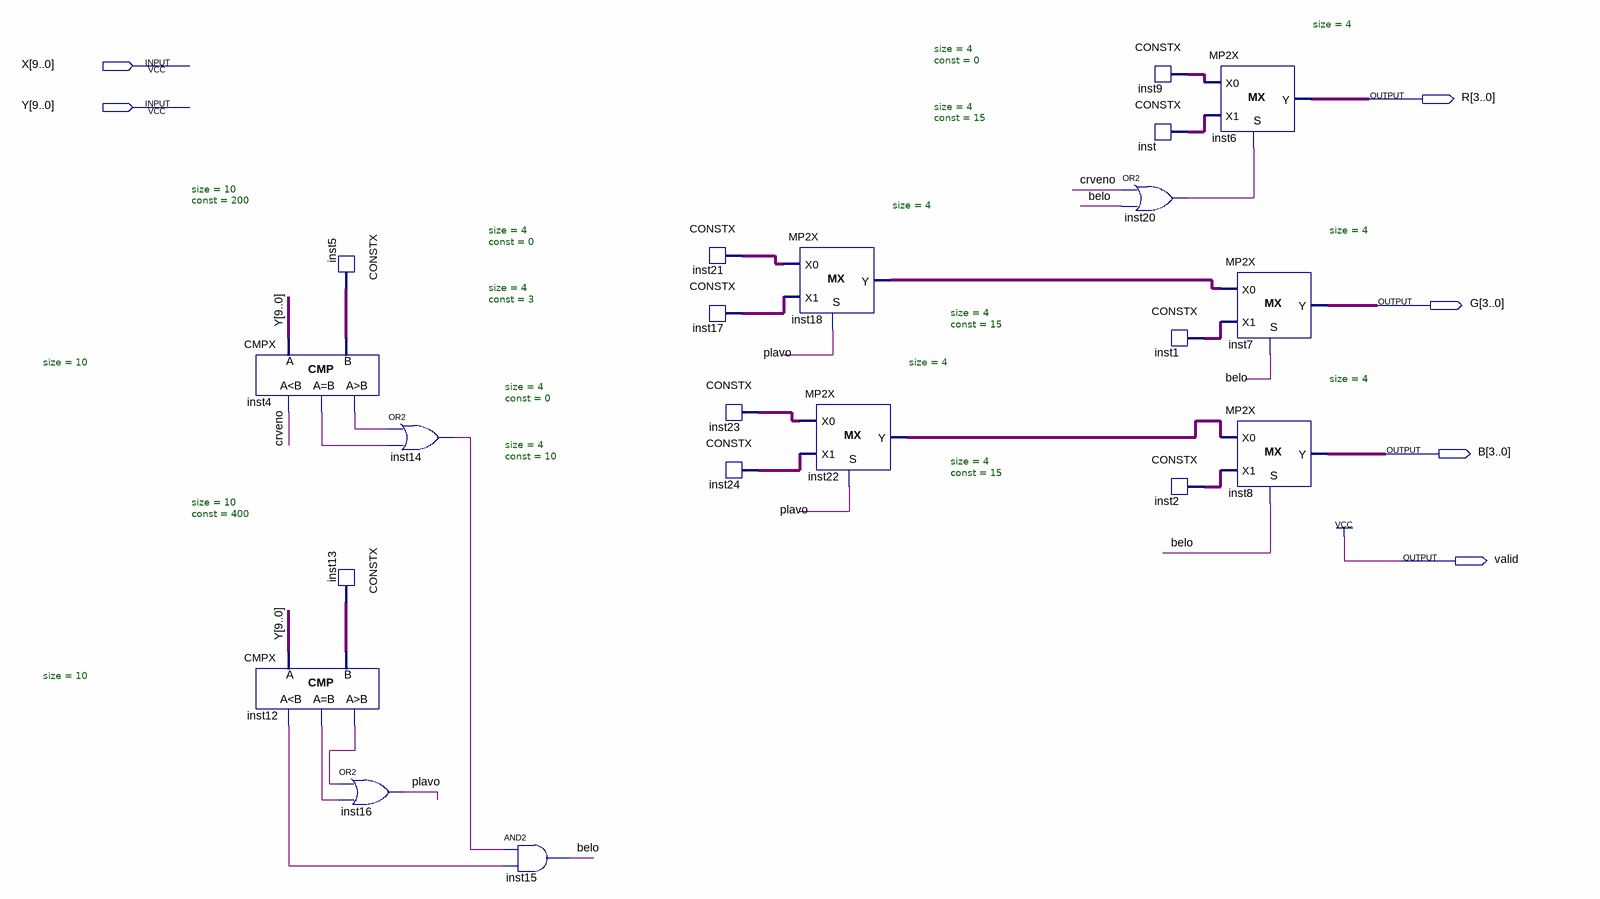
[diagram p0: schematic sheet]
// Quartus schematic Nizozemska.bdf as structural Verilog: 21 symbols, 6 pins
module Nizozemska (
  input  [9:0] X,
  input  [9:0] Y,
  output [3:0] R,
  output [3:0] G,
  output [3:0] B,
  output valid
);

  wire belo, crveno, inst4_eq, inst4_gr, inst12_eq, inst12_gr, inst12_ls, inst14_out, inst20_out, plavo;
  wire [3:0] inst1_data, inst2_data, inst9_data, inst17_data, inst18_y, inst21_data, inst22_y, inst23_data,
       inst24_data, inst_data;
  wire [9:0] inst5_data, inst13_data;

  CMPX #(.size(10)) inst4 (.A(Y), .B(inst5_data), .ls(crveno), .eq(inst4_eq), .gr(inst4_gr));
  CMPX #(.size(10)) inst12 (.A(Y), .B(inst13_data), .ls(inst12_ls), .eq(inst12_eq), .gr(inst12_gr));
  CONSTX #(.size(10), .\const (200)) inst5 (.data(inst5_data));
  CONSTX #(.size(10), .\const (400)) inst13 (.data(inst13_data));
  or inst16 (plavo, inst12_gr, inst12_eq);
  or inst14 (inst14_out, inst4_gr, inst4_eq);
  and inst15 (belo, inst14_out, inst12_ls);
  CONSTX #(.size(4), .\const (0)) inst21 (.data(inst21_data));
  CONSTX #(.size(4), .\const (3)) inst17 (.data(inst17_data));
  CONSTX #(.size(4), .\const (0)) inst23 (.data(inst23_data));
  CONSTX #(.size(4), .\const (10)) inst24 (.data(inst24_data));
  MP2X #(.size(4)) inst18 (.S(plavo), .X0(inst21_data), .X1(inst17_data), .Y(inst18_y));
  MP2X #(.size(4)) inst22 (.S(plavo), .X0(inst23_data), .X1(inst24_data), .Y(inst22_y));
  CONSTX #(.size(4), .\const (0)) inst9 (.data(inst9_data));
  CONSTX #(.size(4), .\const (15)) inst (.data(inst_data));
  or inst20 (inst20_out, crveno, belo);
  MP2X #(.size(4)) inst6 (.S(inst20_out), .X0(inst9_data), .X1(inst_data), .Y(R));
  CONSTX #(.size(4), .\const (15)) inst1 (.data(inst1_data));
  CONSTX #(.size(4), .\const (15)) inst2 (.data(inst2_data));
  MP2X #(.size(4)) inst7 (.S(belo), .X0(inst18_y), .X1(inst1_data), .Y(G));
  MP2X #(.size(4)) inst8 (.S(belo), .X0(inst22_y), .X1(inst2_data), .Y(B));

  assign valid = 1'b1;
endmodule
